# Altium schematic sheet 05_power.SchDoc
size D; CompanyName: Signal Laboratories, Inc.; Address1: 3479 Edison Way; Address2: Menlo Park CA 94025; Address3: +1 (877) 778-8435; Address4: siglabs.com; Revision: 1; SheetNumber: 1; SheetTotal: 1
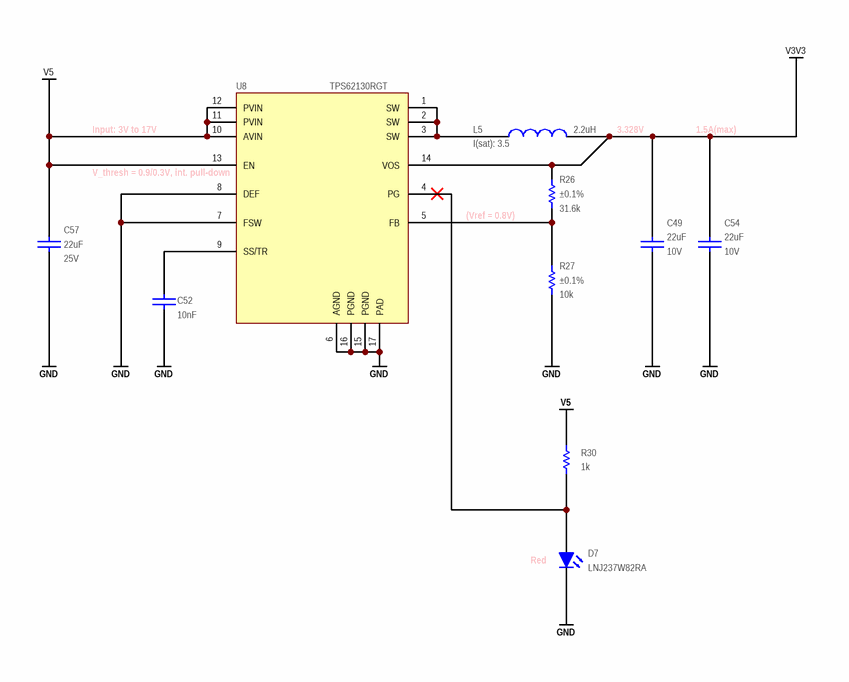
[diagram p0: 05_power.SchDoc]

## Parts
C49  value 22uF  Voltage: 10V  [CAPC200X125X145L45N]  (hidden comment: C2012X7S1A226M125)
C52  value 10nF  [CAPC100X50X55L25N]  (hidden comment: GRM155R71H103KA88)
C54  value 22uF  Voltage: 10V  [CAPC200X125X145L45N]  (hidden comment: C2012X7S1A226M125)
C57  value 22uF  Voltage: 25V  [CAPC320X250X270L50N]  (hidden comment: GRM32ER71E226KE15)
D7  LNJ237W82RA  [0603_LED]
L5  value 2.2uH  I(sat): 3.5  [XFL4020]  (hidden comment: XFL4020-222ME)
R26  value 31.6k  Tolerance: ±0.1%  [RESC2012X70N]  (hidden comment: ERA-6AEB3162V)
R27  value 10k  Tolerance: ±0.1%  [RESC2012X70N]  (hidden comment: ERA-6AEB103V)
R30  value 1k  [RESC1005X40N]  (hidden comment: ERJ-2RKF1001X)
U8  TPS62130RGT  [S-PQFP-8N]

## Nets
GND: C49.1 C52.2 C54.1 C57.1 D7.2(K) R27.1 U8.6(AGND) U8.7(FSW) U8.8(DEF) U8.15(PGND) U8.16(PGND) U8.17(PAD)
V3V3: C49.2 C54.2 L5.2 R26.2 U8.14(VOS)
V5: C57.2 R30.2 U8.10(AVIN) U8.11(PVIN) U8.12(PVIN) U8.13(EN)
NetC52_1: C52.1 U8.9(SS/TR)
NetD7_1: D7.1(A) R30.1 U8.4(PG)
NetL5_1: L5.1 U8.1(SW) U8.2(SW) U8.3(SW)
NetR26_1: R26.1 R27.2 U8.5(FB)

## Notes on the sheet
- Input: 3V to 17V
- 3.328V
- 1.5A(max)
- (near U8) V_thresh = 0.9/0.3V, int. pull-down
- (near R26) (Vref = 0.8V)
- (near D7) Red
- Title
- Engineer
- Revision
- Drawn By
- Sheet
- of
- Checked By
- Date

## Library data of the parts
C49 C54 = CAP: Ceramic Capacitor 22uF ±20% 10V X7S 0805; Manufacturer: TDK; Tr: -55:125; Manufacturer P/N: C2012X7S1A226M125; Tolerance: ±20%; Package: 0805
C52 = CAP: Ceramic Capacitor 10nF ±10% 50V X7R 0402; Manufacturer: Murata; Tr: -55:125; Manufacturer P/N: GRM155R71H103KA88; Tolerance: ±10%; Voltage: 50V; Package: 0402
C57 = CAP: Ceramic Capacitor 22uF ±10% 25V X7R 1210; Manufacturer: Murata; Tr: -55:125; Manufacturer P/N: GRM32ER71E226KE15; Tolerance: ±10%; Package: 1210
D7 = LED0603RD: LED, SMT 0603, Color Red, 5mA, 1.85V; Manufacturer: Panasonic; Manufacturer P/N: LNJ237W82RA; Package: 0603 Polarized
L5 = COIL: Wirewound Inductor 2.2uH +/-20% 3.5A SMD; Manufacturer: Coilcraft; Manufacturer P/N: XFL4020-222ME
R26 = RES: Thin Film Resistor 31.6k ±0.1% 0.125W 100V 0805; Manufacturer: Panasonic; Tcr: ±25; Tr: -55:155; Voltage: 100; Power: 0.125; Manufacturer P/N: ERA-6AEB3162V; Package: 0805
R27 = RES: Thin Film Resistor 10k ±0.1% 0.125W 100V 0805; Manufacturer: Panasonic; Tcr: ±25; Tr: -55:155; Voltage: 100; Power: 0.125; Manufacturer P/N: ERA-6AEB103V; Package: 0805
R30 = RES: Thick Film Resistor 1k ±1% 0.1W 0402; Manufacturer: Panasonic; Tcr: ±100; Tr: -55:155; Voltage: 50; Power: 0.1; Manufacturer P/N: ERJ-2RKF1001X; Tolerance: ±1%; Alternatives: *; Footprint: *; Package: 0402
U8 = TPS62130RGT: 3-17V 3A Step-Down Converter VQFN; Manufacturer: Texas Instruments; Manufacturer P/N: TPS62130RGT